# Altium schematic sheet H-Watch.SchDoc: H-Watch Main
size A3; DrawnBy: schuluka; Organization: ETH-PBL; DocumentNumber: SCH1V0.2; Revision: V0.2; SheetNumber: 1; SheetTotal: 5
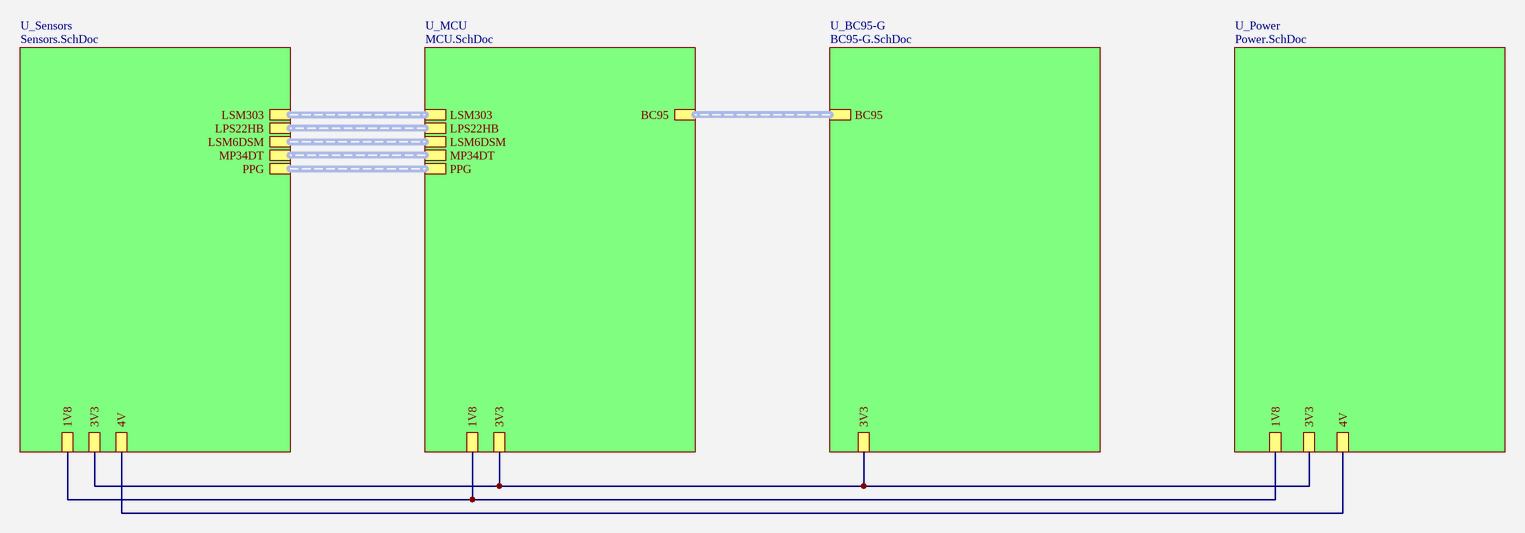
[diagram p0: H-Watch.SchDoc]

## Sub-sheets
U_BC95-G = BC95-G.SchDoc: BC95 (harness H8), 3V3
U_MCU = MCU.SchDoc: 1V8, 3V3, LSM303 (harness *), LPS22HB (harness *), LSM6DSM (harness *), MP34DT (harness *), PPG (harness *), BC95 (harness H8)
U_Power = Power.SchDoc: 1V8, 3V3, 4V
U_Sensors = Sensors.SchDoc: PPG (harness *), MP34DT (harness *), LSM6DSM (harness *), LPS22HB (harness *), LSM303 (harness *), 1V8, 4V, 3V3

## Nets
(unnamed): sheet U_Sensors/1V8, sheet U_Power/1V8, sheet U_MCU/1V8
(unnamed): sheet U_Sensors/4V, sheet U_Power/4V
(unnamed): sheet U_Sensors/3V3, sheet U_Power/3V3, sheet U_MCU/3V3, sheet U_BC95-G/3V3

## Buses and harness runs
harness sheet U_BC95-G/BC95 = sheet U_MCU/BC95
harness sheet U_MCU/LPS22HB = sheet U_Sensors/LPS22HB
harness sheet U_MCU/LSM6DSM = sheet U_Sensors/LSM6DSM
harness sheet U_MCU/LSM303 = sheet U_Sensors/LSM303
harness sheet U_MCU/MP34DT = sheet U_Sensors/MP34DT
harness sheet U_MCU/PPG = sheet U_Sensors/PPG

## Notes on the sheet
- 1
- 2
- 3
- 4
- 5
- 6
- 7
- 8
- A
- B
- C
- D
- Project:
- Date:
- Drawing number:
- Rev:
- Format:
- A3
- Drawn by:
- Laboratory:
- Page
- Sheet:
- of
- File: